# Altium schematic sheet debug.SchDoc
size A4
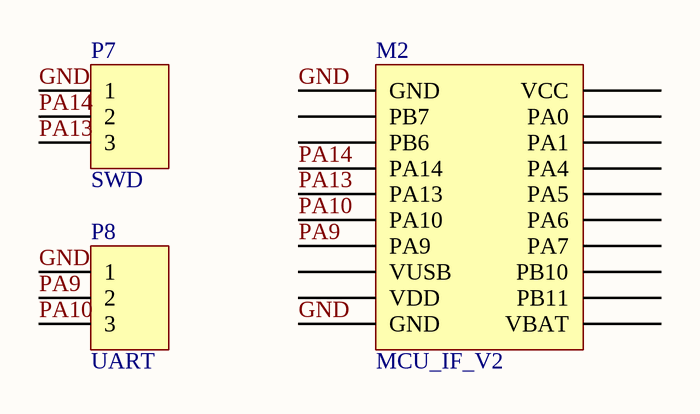
[diagram p0: debug.SchDoc]

## Parts
M2  MCU_IF_V2  [MCU_IF_V2]
P7  SWD  [EDGE_3_2.54]
P8  UART  [EDGE_3_2.54]

## Nets
GND: M2.1(GND) M2.10(GND) P7.1 P8.1
PA9: M2.7(PA9) P8.2
PA10: M2.6(PA10) P8.3
PA13: M2.5(PA13) P7.3
PA14: M2.4(PA14) P7.2

Not connected (* = marked no-connect by the designer): M2 2(PB7) 3(PB6) 8(VUSB) 9(VDD) 11(VBAT) 12(PB11) 13(PB10) 14(PA7) 15(PA6) 16(PA5) 17(PA4) 18(PA1) 19(PA0) 20(VCC)

## Library data of the parts
M2 = MCU_IF_V1
P7 P8 = Header 3: Header, 3-Pin; LatestRevisionDate: 17-Jul-2002; LatestRevisionNote: Re-released for DXP Platform.; Publisher: Altium Limited